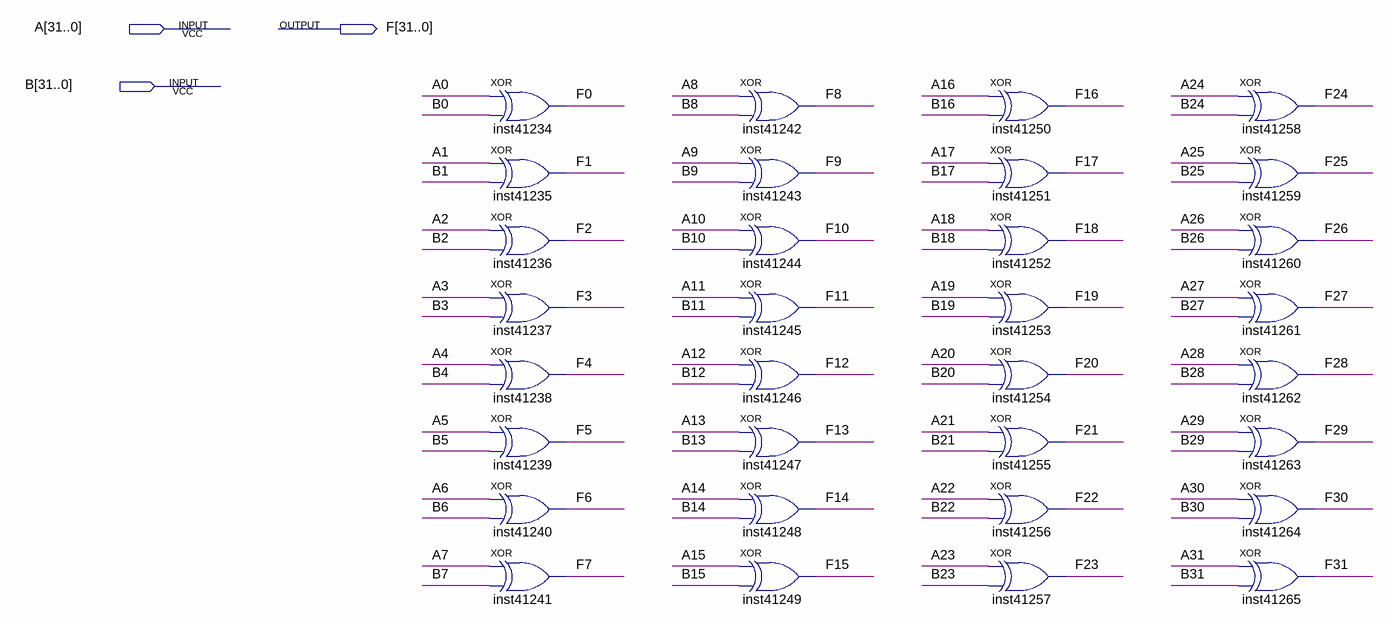
[diagram p0: schematic sheet]
// Quartus schematic XOR32.bdf as structural Verilog: 32 symbols, 3 pins
module XOR32 (
  input  [31:0] A,
  input  [31:0] B,
  output [31:0] F
);

  xor inst41234 (F[0], A[0], B[0]);
  xor inst41235 (F[1], A[1], B[1]);
  xor inst41236 (F[2], A[2], B[2]);
  xor inst41237 (F[3], A[3], B[3]);
  xor inst41238 (F[4], A[4], B[4]);
  xor inst41239 (F[5], A[5], B[5]);
  xor inst41240 (F[6], A[6], B[6]);
  xor inst41241 (F[7], A[7], B[7]);
  xor inst41242 (F[8], A[8], B[8]);
  xor inst41243 (F[9], A[9], B[9]);
  xor inst41244 (F[10], A[10], B[10]);
  xor inst41245 (F[11], A[11], B[11]);
  xor inst41246 (F[12], A[12], B[12]);
  xor inst41247 (F[13], A[13], B[13]);
  xor inst41248 (F[14], A[14], B[14]);
  xor inst41249 (F[15], A[15], B[15]);
  xor inst41250 (F[16], A[16], B[16]);
  xor inst41251 (F[17], A[17], B[17]);
  xor inst41252 (F[18], A[18], B[18]);
  xor inst41253 (F[19], A[19], B[19]);
  xor inst41254 (F[20], A[20], B[20]);
  xor inst41255 (F[21], A[21], B[21]);
  xor inst41256 (F[22], A[22], B[22]);
  xor inst41257 (F[23], A[23], B[23]);
  xor inst41258 (F[24], A[24], B[24]);
  xor inst41259 (F[25], A[25], B[25]);
  xor inst41260 (F[26], A[26], B[26]);
  xor inst41261 (F[27], A[27], B[27]);
  xor inst41262 (F[28], A[28], B[28]);
  xor inst41263 (F[29], A[29], B[29]);
  xor inst41264 (F[30], A[30], B[30]);
  xor inst41265 (F[31], A[31], B[31]);
endmodule
